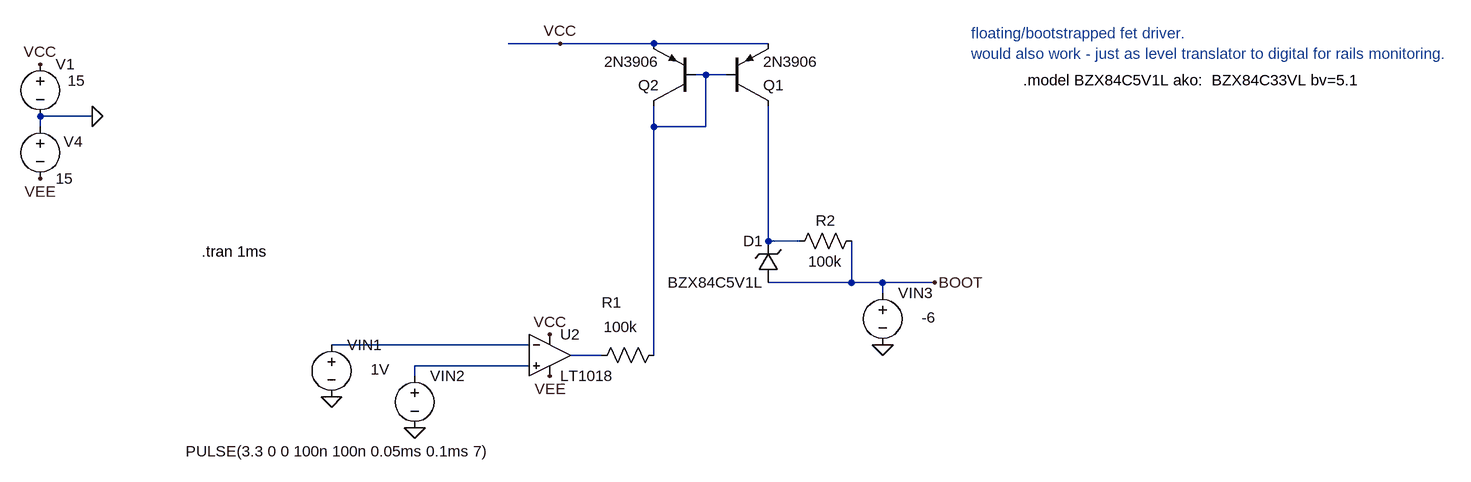
[diagram p0: schematic Draft01.asc]
Draft01.asc, the LTspice schematic file:
Version 4
SHEET 1 2756 2104
WIRE 48 -656 -32 -656
WIRE 192 -656 48 -656
WIRE 368 -656 192 -656
WIRE 272 -608 256 -608
WIRE 304 -608 272 -608
WIRE -672 -544 -752 -544
WIRE -752 -528 -752 -544
WIRE 192 -528 192 -560
WIRE 272 -528 272 -608
WIRE 272 -528 192 -528
WIRE 368 -352 368 -560
WIRE 416 -352 368 -352
WIRE 496 -288 496 -352
WIRE 496 -288 368 -288
WIRE 544 -288 496 -288
WIRE 624 -288 544 -288
WIRE 544 -272 544 -288
WIRE 0 -192 -304 -192
WIRE 112 -176 64 -176
WIRE 192 -176 192 -528
WIRE 0 -160 -176 -160
WIRE -176 -144 -176 -160
FLAG -752 -624 VCC
FLAG -752 -448 VEE
FLAG -672 -544 0
FLAG 32 -208 VCC
FLAG 32 -144 VEE
FLAG 544 -192 0
FLAG -176 -64 0
FLAG -304 -112 0
FLAG 48 -656 VCC
FLAG 624 -288 BOOT
SYMBOL voltage -752 -640 R0
WINDOW 123 0 0 Left 0
WINDOW 39 0 0 Left 0
WINDOW 3 42 41 Left 2
SYMATTR Value 15
SYMATTR InstName V1
SYMBOL voltage -752 -544 R0
WINDOW 123 0 0 Left 0
WINDOW 39 0 0 Left 0
WINDOW 0 36 39 Left 2
SYMATTR InstName V4
SYMATTR Value 15
SYMBOL res 208 -192 R90
WINDOW 0 -50 81 VBottom 2
WINDOW 3 -43 67 VTop 2
SYMATTR InstName R1
SYMATTR Value 100k
SYMBOL Comparators\\LT1018 32 -176 R0
SYMATTR InstName U2
SYMBOL pnp 304 -560 M180
SYMATTR InstName Q1
SYMATTR Value 2N3906
SYMBOL pnp 256 -560 R180
SYMATTR InstName Q2
SYMATTR Value 2N3906
SYMBOL res 400 -336 R270
WINDOW 0 32 56 VTop 2
WINDOW 3 0 56 VBottom 2
SYMATTR InstName R2
SYMATTR Value 100k
SYMBOL voltage -176 -160 R0
WINDOW 123 0 0 Left 0
WINDOW 39 0 0 Left 0
WINDOW 3 -352 132 Left 2
SYMATTR Value PULSE(3.3 0 0 100n 100n 0.05ms 0.1ms 7)
SYMATTR InstName VIN2
SYMBOL voltage 544 -288 R0
WINDOW 123 0 0 Left 0
WINDOW 39 0 0 Left 0
WINDOW 3 60 54 Left 2
SYMATTR Value -6
SYMATTR InstName VIN3
SYMBOL voltage -304 -208 R0
WINDOW 123 0 0 Left 0
WINDOW 39 0 0 Left 0
WINDOW 3 60 54 Left 2
SYMATTR Value 1V
SYMATTR InstName VIN1
SYMBOL zener 384 -288 R180
WINDOW 0 24 64 Left 2
WINDOW 3 24 0 Left 2
SYMATTR InstName D1
SYMATTR Value BZX84C5V1L
TEXT -504 -336 Left 2 !.tran 1ms
TEXT 680 -672 Left 2 ;floating/bootstrapped fet driver.\nwould also work - just as level translator to digital for rails monitoring.
TEXT 760 -600 Left 2 !.model BZX84C5V1L ako:  BZX84C33VL bv=5.1

The netlist it stands for:
* Draft01.asc
V1 VCC 0 15
V4 0 VEE 15
R1 N001 N004 100k
XU2 N005 N003 VCC VEE N004 LT1018  ; pins In+ In- V+ V- OUT
Q1 N002 N001 VCC 0 2N3906
Q2 N001 N001 VCC 0 2N3906
R2 N002 BOOT 100k
VIN2 N005 0 PULSE(3.3 0 0 100n 100n 0.05ms 0.1ms 7)
VIN3 BOOT 0 -6
VIN1 N003 0 1V
D1 BOOT N002 BZX84C5V1L
.model D D
.lib standard.dio
.model NPN NPN
.model PNP PNP
.lib standard.bjt
.tran 1ms
* floating/bootstrapped fet driver.
* would also work - just as level translator to digital for rails monitoring.
.model BZX84C5V1L ako:  BZX84C33VL bv=5.1
.lib LTC1.lib
.backanno
.end